# EAGLE design 12v+:- PSU v2 (EAGLE 9.3.0)
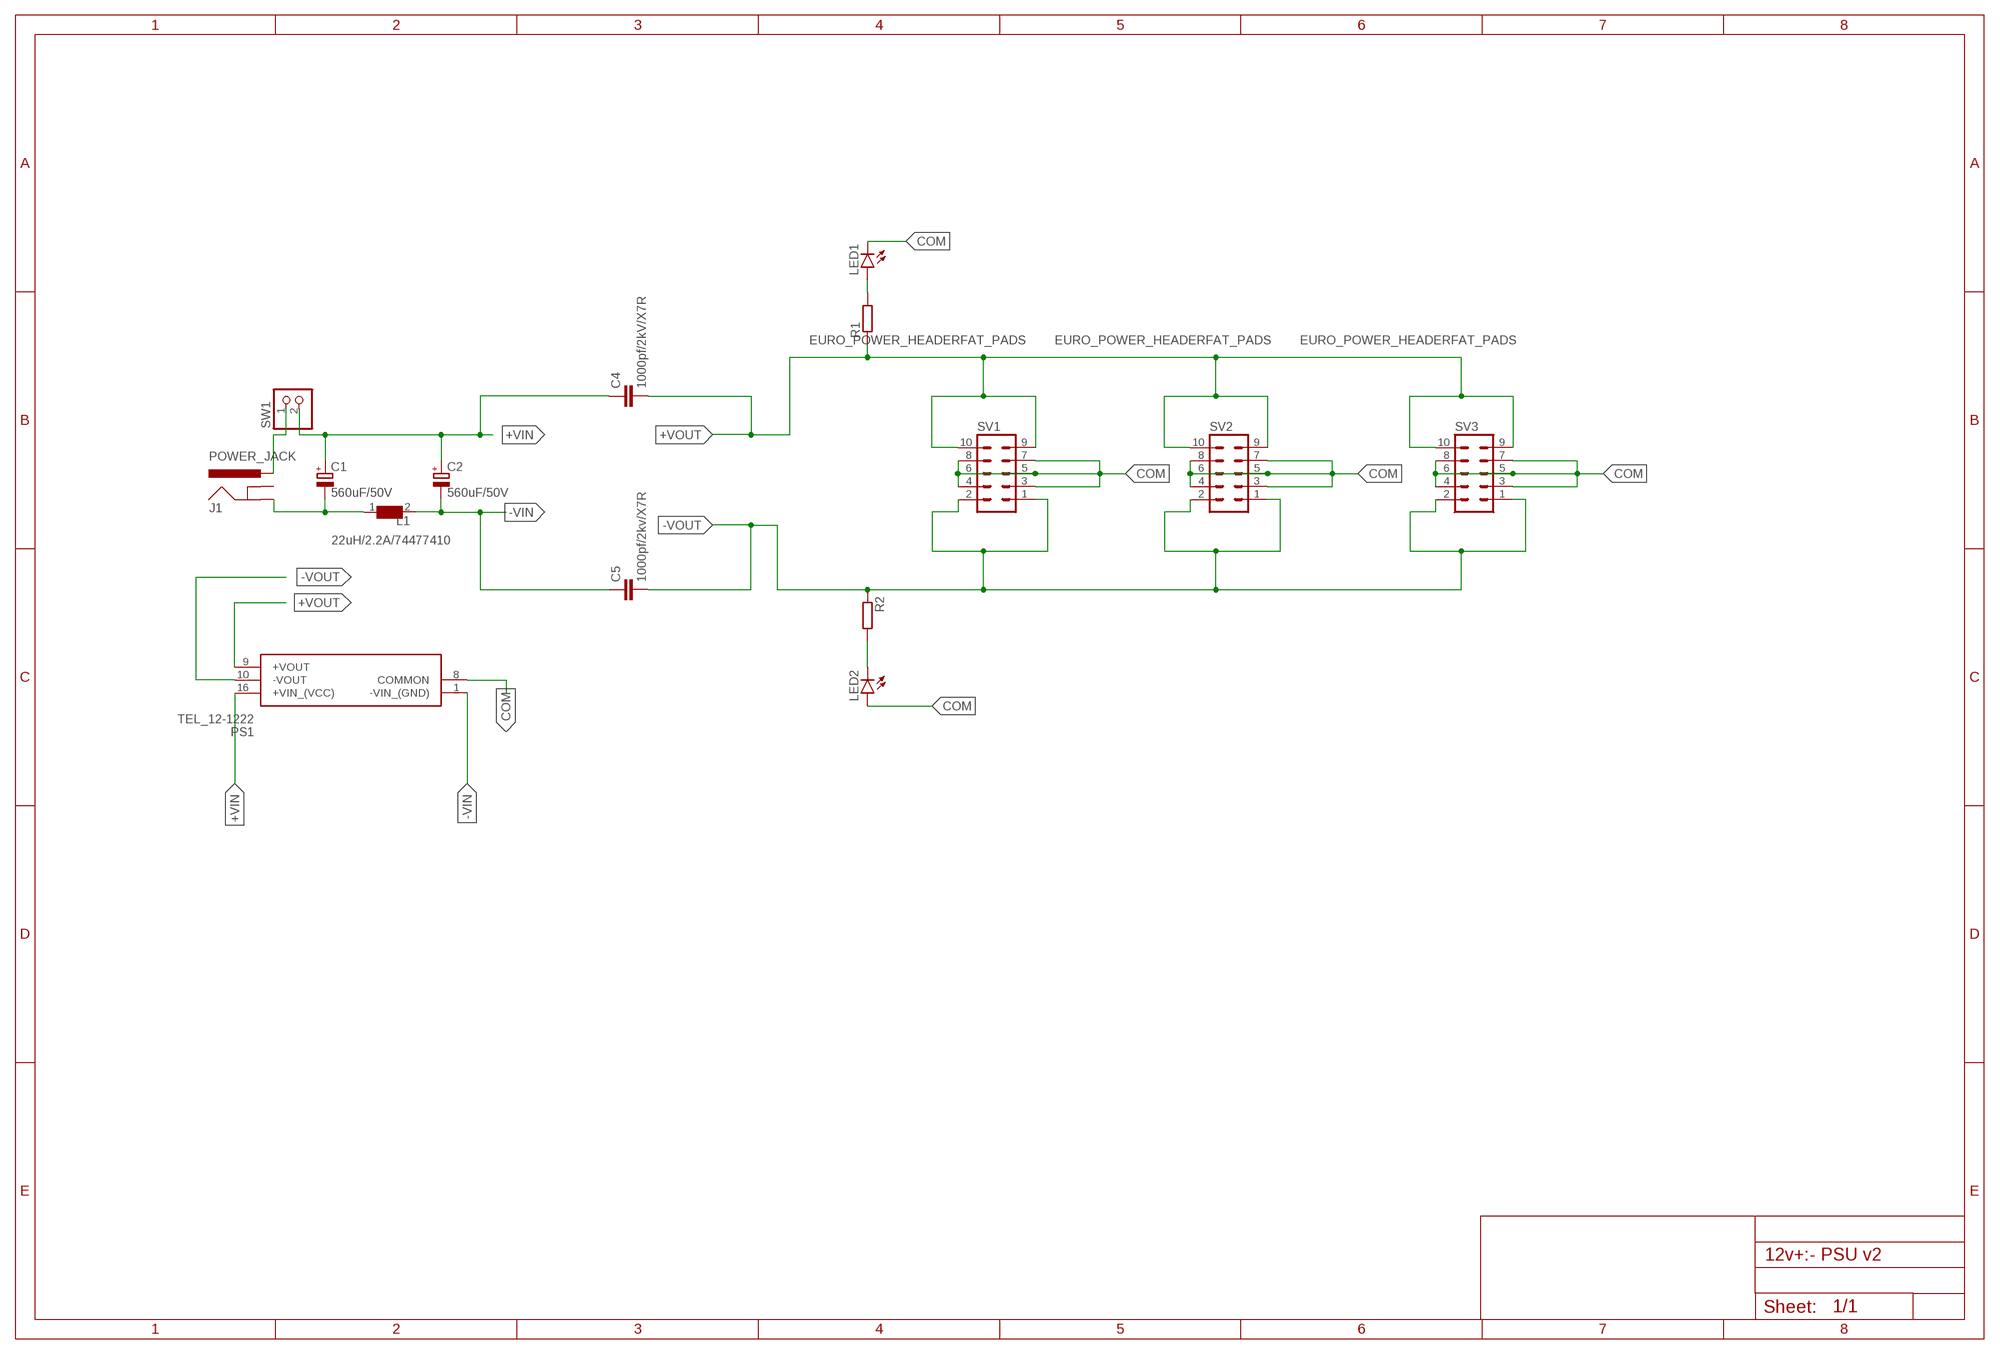
[diagram p0: schematic, sheet 1]

## Parts
C1  560uF/50V  CPOL-EUE7.5-16  [E7,5-16]
C2  560uF/50V  CPOL-EUE7.5-16  [E7,5-16]
C4  1000pf/2kV/X7R  C-EUC1808  [C1808]
C5  1000pf/2kv/X7R  C-EUC1808  [C1808]
J1  POWER_JACK  [POWER_JACK_PTH]
L1  22uH/2.2A/74477410  WE-PD2-74477410_5848/5820  [WE-PD2_5848/5820]
LED1  LED3MM  [LED3MM]
LED2  LED3MM  [LED3MM]
PS1  TEL_12-1222  [TEL121222]
R1  RESISTOR7MM  [7MM_RESISTOR]
R2  RESISTOR7MM  [7MM_RESISTOR]
SV1  EURO_POWER_HEADERFAT_PADS  [EURO_PWR_HEADER_FAT]
SV2  EURO_POWER_HEADERFAT_PADS  [EURO_PWR_HEADER_FAT]
SV3  EURO_POWER_HEADERFAT_PADS  [EURO_PWR_HEADER_FAT]
SW1  PINHD-1X2  [1X02]

## Nets
+VIN: C1.+ C2.+ C4.1 PS1.16(+VIN_(VCC)) SW1.2
+VOUT: C4.2 PS1.9(+VOUT) R1.1 SV1.9 SV1.10 SV2.9 SV2.10 SV3.9 SV3.10
-VIN: C2.- C5.1 L1.2 PS1.1(-VIN_(GND))
-VOUT: C5.2 PS1.10(-VOUT) R2.1 SV1.1 SV1.2 SV2.1 SV2.2 SV3.1 SV3.2
COM: LED1.K(C) LED2.A PS1.8(COMMON) SV1.3 SV1.4 SV1.5 SV1.6 SV1.7 SV1.8 SV2.3 SV2.4 SV2.5 SV2.6 SV2.7 SV2.8 SV3.3 SV3.4 SV3.5 SV3.6 SV3.7 SV3.8
N$1: J1.PWR SW1.1
N$2: C1.- J1.GND L1.1
N$3: LED1.A R1.2
N$4: LED2.K(C) R2.2
Unconnected: J1.GNDBREAK

## Library data of the parts
C1 C2 = rcl:CPOL-EU: POLARIZED CAPACITOR, European symbol; SPICEPREFIX: C
C4 C5 = rcl:C-EU: CAPACITOR, European symbol; SPICEPREFIX: C
J1 = SparkFun-Connectors:POWER_JACK: Power Jack Connector This is the standard 5.5mm barrel jack for power. The PTH is the most common, proven, reliable, footprint. The Slot footprint only works if the mill layer is transmitted to the PCB fab house so be warned. Here are the connectors we sell at SparkFun: DC Barrel Power Jack/Connector <https://www.sparkfun.com/products/119> (PRT-00119) DC Barrel Power Jack/Connector (SMD) <https://www.sparkfun.com/products/12748> (PRT-12748) DC Barrel Jack Adapter - Breadboard Compatible <https://www.sparkfun.com/products/10811> (PRT-10811) It is used on this SparkFun product (and many, many others): SparkFun RedBoard - Programmed with Arduino <https://www.sparkfun.com/products/12757> (DEV-12757) Also, if you need a mating power supply or connector, please check these out: Wall Adapter Power Supply - 9VDC 650mA <https://www.sparkfun.com/products/298> (TOL-00298) DC Barrel Jack Adapter - Male <https://www.sparkfun.com/products/10287> (PRT-10287); PROD_ID: CONN-08197
L1 = WE-PD2:WE-PD2: SMD-Power Inductors WE-PD2 - Industry standard size - Current capability up to 14 A -- Switching regulators with low operating voltages (computer, laptop, mobile phones, pagers) -- Integrated DC/DC-converter -- Is recommended for the application with switching regulators from National Semiconductor, Linear Technology, Texas Instruments and Fairchild Semiconductor -- Perfectly suitable for switching regulators with extremely high efficiency; MPN: 74477410; OC_FARNELL: 1636014; OC_NEWARK: 08P2817; PACKAGE: 5848; SUPPLIER: Wuerth Elektronik
LED1 LED2 = led:LED: LED OSRAM: - CHIPLED LG R971, LG N971, LY N971, LG Q971, LY Q971, LO R971, LY R971 LH N974, LH R974 LS Q976, LO Q976, LY Q976 LO Q996 - Hyper CHIPLED LW Q18S LB Q993, LB Q99A, LB R99A - SideLED LS A670, LO A670, LY A670, LG A670, LP A670 LB A673, LV A673, LT A673, LW A673 LH A674 LY A675 LS A676, LA A676, LO A676, LY A676, LW A676 LS A679, LY A679, LG A679 - Hyper Micro SIDELED® LS Y876, LA Y876, LO Y876, LY Y876 LT Y87S - SmartLED LW L88C, LW L88S LB L89C, LB L89S, LG L890 LS L89K, LO L89K, LY L89K LS L896, LA L896, LO L896, LY L896 - TOPLED LS T670, LO T670, LY T670, LG T670, LP T670 LSG T670, LSP T670, LSY T670, LOP T670, LYG T670 LG T671, LOG T671, LSG T671 LB T673, LV T673, LT T673, LW T673 LH T674 LS T676, LA T676, LO T676, LY T676, LB T676, LH T676, LSB T676, LW T676 LB T67C, LV T67C, LT T67C, LS T67K, LO T67K, LY T67K, LW E67C LS E67B, LA E67B, LO E67B, LY E67B, LB E67C, LV E67C, LT E67C LW T67C LS T679, LY T679, LG T679 LS T770, LO T770, LY T770, LG T770, LP T770 LB T773, LV T773, LT T773, LW T773 LH T774 LS E675, LA E675, LY E675, LS T675 LS T776, LA T776, LO T776, LY T776, LB T776 LHGB T686 LT T68C, LB T68C - Hyper Mini TOPLED® LB M676 - Mini TOPLED Santana® LG M470 LS M47K, LO M47K, LY M47K Source: http://www.osram.convergy.de LUXEON: - LUMILED® LXK2-PW12-R00, LXK2-PW12-S00, LXK2-PW14-U00, LXK2-PW14-V00 LXK2-PM12-R00, LXK2-PM12-S00, LXK2-PM14-U00 LXK2-PE12-Q00, LXK2-PE12-R00, LXK2-PE12-S00, LXK2-PE14-T00, LXK2-PE14-U00 LXK2-PB12-K00, LXK2-PB12-L00, LXK2-PB12-M00, LXK2-PB14-N00, LXK2-PB14-P00, LXK2-PB14-Q00 LXK2-PR12-L00, LXK2-PR12-M00, LXK2-PR14-Q00, LXK2-PR14-R00 LXK2-PD12-Q00, LXK2-PD12-R00, LXK2-PD12-S00 LXK2-PH12-R00, LXK2-PH12-S00 LXK2-PL12-P00, LXK2-PL12-Q00, LXK2-PL12-R00 Source: www.luxeon.com KINGBRIGHT: KA-3528ASYC Source: www.kingbright.com
PS1 = MusicThingModular:TEL_12-1222: 12 Watt DC/DC converter, industrial, 2:1 input, ultra compact design, encapsulated, DIP-16 metal package Source: Datasheet <https://tracopower.com/tel12-datasheet/>; DESCRIPTION: 12 Watt DC/DC converter, industrial, 2:1 input, ultra compact design, encapsulated, DIP-16 metal package; HEIGHT: 10.45mm; MANUFACTURER_NAME: Traco Power; MANUFACTURER_PART_NUMBER: TEL 12-1222; MOUSER_PART_NUMBER: 495-TEL12-1222; MOUSER_PRICE-STOCK: https://www.mouser.co.uk/ProductDetail/TRACO-Power/TEL-12-1222?qs=hd1VzrDQEGiVJ55EfrLu8Q%3D%3D
R1 R2 = MusicThingModular:RESISTOR: Standard resistor, various versions
SV1-SV3 = MusicThingModular:EURO_POWER_HEADER: Power Header 10 pin power header for Eurorack Power Supplies Variants with fatter pads for easier soldering, and the LOCK variant which has 5mil offset pins to hold the component in place before soldering
SW1 = pinhead:PINHD-1X2: PIN HEADER

## Board
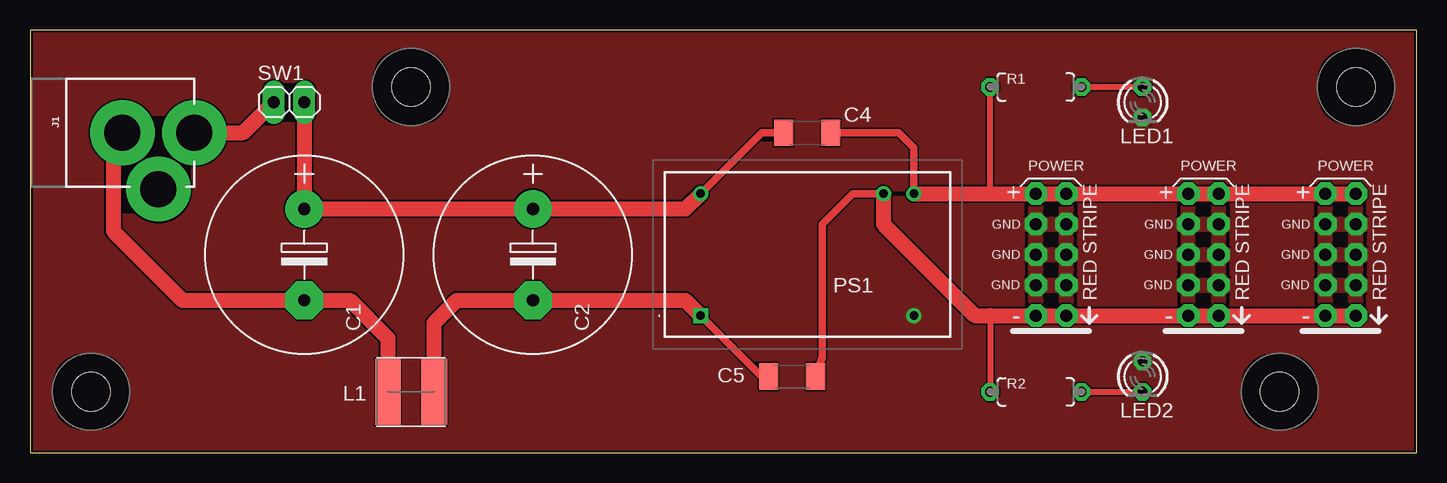
[diagram p1: board, top side]

Size 115.55 x 35.23 mm. Coordinates in mm from the lower left corner, seen from the top.
Outline: 0,0 115.55,0 115.55,35.23 0,35.23 0,0
Copper layers (1*16): Top 0.035mm / dielectric 1.6mm / Bottom 0.035mm
Design rules "jlcpcb-2layers": minimum track width 5mil, minimum drill 0.3mm, track to track 5mil, track to pad 5mil, pad to pad 5mil, via to via 5mil, smd to smd 5mil, copper to edge 0.2mm, drill to drill 6mil, minimum pad ring 10mil, minimum via ring 3mil, stop-mask expansion 4mil, vias tented up to drill 0mil, thermal gap 10mil

### Footprints (pad centres in the part's own frame; a part is rotated, then mirrored left to right if it is on the bottom)
E7,5-16 = drill 1.016 pad 3.15: + -3.81,0 | drill 1.016 pad 3.15 octagon: - 3.81,0
C1808 = smd 1.6 x 2.2: 1 -1.95,0; 2 1.95,0
POWER_JACK_PTH = drill 2.997 pad 4.318: GND 0,7.7; GNDBREAK 4.7,10.7; PWR 0,13.7
WE-PD2_5848/5820 = smd 2.15 x 5.5: 1 -1.925,0; 2 1.925,0
LED3MM = drill 0.813 octagon: A -1.27,0; K 1.27,0
TEL121222 = drill 0.7 pad 1.2 square: 1 0,0 | drill 0.7 pad 1.2: 8 17.78,0; 9 17.78,10.16; 10 15.24,10.16; 16 0,10.16
7MM_RESISTOR = drill 0.813 octagon: 1 -3.81,0; 2 3.81,0
EURO_PWR_HEADER_FAT = drill 1.016 pad 1.88 octagon: 1 -5.08,-1.27; 2 -5.08,1.27; 3 -2.54,-1.27; 4 -2.54,1.27; 5 0,-1.27; 6 0,1.27; 7 2.54,-1.27; 8 2.54,1.27; 9 5.08,-1.27; 10 5.08,1.27
1X02 = drill 1.016 long: 1 -1.27,0; 2 1.27,0
MOUNTING_HOLE = hole 3.2: 0,0

### Placement (x,y rotation side)
C1  22.86,16.51 270 top
C2  41.91,16.51 270 top
C4  64.77,26.67 0 top
C5  63.5,6.35 0 top
J1  0,26.67 270 top
L1  31.75,5.08 0 top
LED1  92.71,29.21 270 top
LED2  92.71,6.35 270 top
PS1  55.88,11.43 0 top
R1  83.82,30.48 0 top
R2  83.82,5.08 0 top
SV1  85.09,16.51 90 top
SV2  97.79,16.51 90 top
SV3  109.22,16.51 90 top
SW1  21.59,29.21 0 top
U$1  [MOUNTING_HOLE]  110.49,30.48 0 top
U$2  [MOUNTING_HOLE]  104.14,5.08 0 top
U$3  [MOUNTING_HOLE]  5.08,5.08 0 top
U$4  [MOUNTING_HOLE]  31.75,30.48 0 top

### Tracks (layer width: path | path; a pad name or v marks a point on that pad's centre or on a via)
+VIN
  Top 0.61: C4.1 60.96,26.67 PS1.16
  Top 1.27: PS1.16 54.61,20.32 C2.+ C1.+ SW1.2
+VOUT
  Top 0.508: 80.01,21.59 R1.1
  Top 0.61: C4.2 72.39,26.67 73.66,25.4 PS1.9
  Top 1.27: PS1.9 80.01,21.59 SV1.10 SV1.9 SV2.10 SV2.9 SV3.10 SV3.9
-VIN
  Top 0.61: PS1.1 60.96,6.35 C5.1
  Top 1.27: PS1.1 54.61,12.7 C2.- 35.56,12.7 33.67,10.81 L1.2
-VOUT
  Top 0.508: 80.01,11.43 R2.1
  Top 0.61: C5.2 66.04,7.94 66.04,19.05 68.58,21.59 PS1.10
  Top 1.27: PS1.10 71.12,19.05 78.74,11.43 80.01,11.43 SV1.2 SV1.1 SV2.2 SV2.1 SV3.2 SV3.1
COM
  pour Top: 0,35.56 115.57,35.56 115.57,0 0,0
N$1
  Top 1.27: J1.PWR 17.78,26.67 SW1.1
N$2
  Top 1.27: J1.GND 6.94,25.91 6.94,18.46 12.7,12.7 C1.- 26.67,12.7 29.82,9.54 L1.1
N$3
  Top 0.508: R1.2 LED1.A
N$4
  Top 0.508: R2.2 LED2.K